# EAGLE design pca9685 board (EAGLE 7.2.0)
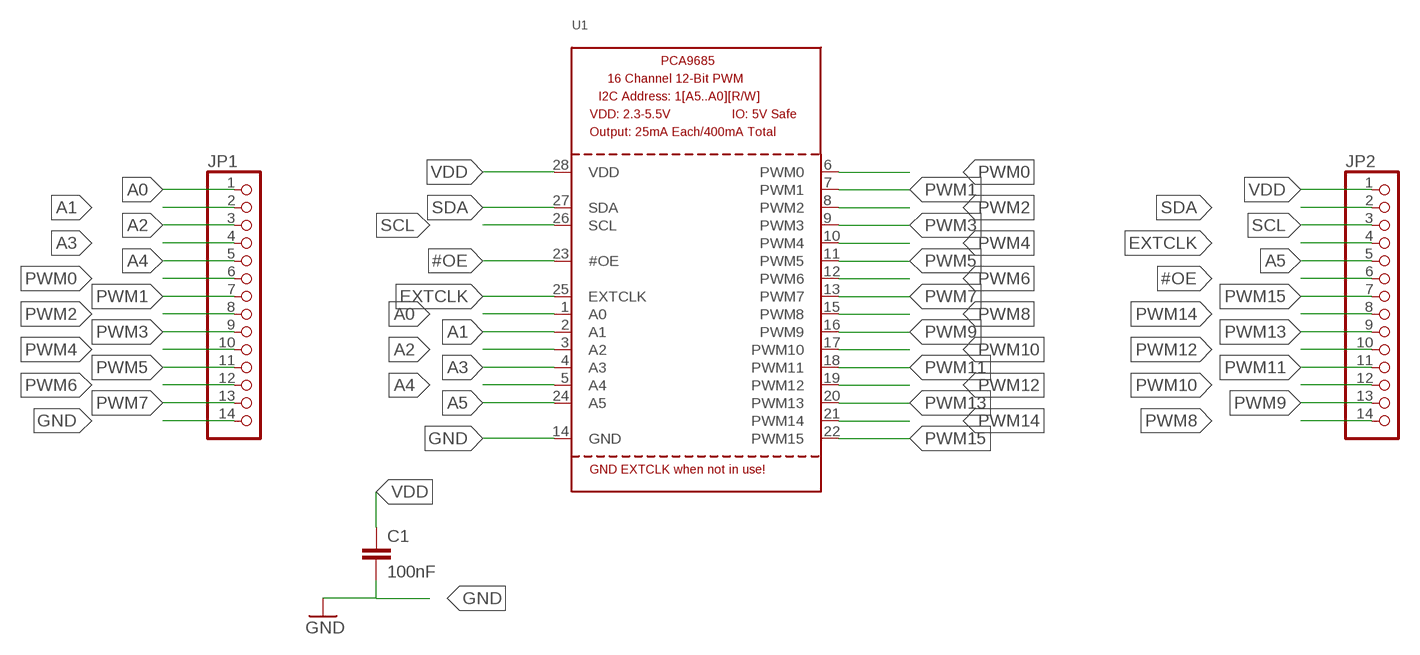
[diagram p0: schematic, sheet 1]

## Parts
C1  100nF  C-EUC0805  [C0805]
JP1  PINHD-1X14  [1X14]
JP2  PINHD-1X14  [1X14]
U1  PCA9685  [TSSOP28]

## Nets
#OE: JP2.6 U1.23(#OE)
A0: JP1.1 U1.1(A0)
A1: JP1.2 U1.2(A1)
A2: JP1.3 U1.3(A2)
A3: JP1.4 U1.4(A3)
A4: JP1.5 U1.5(A4)
A5: JP2.5 U1.24(A5)
EXTCLK: JP2.4 U1.25(EXTCLK)
GND: C1.2 JP1.14 U1.14(GND)
PWM0: JP1.6 U1.6(PWM0)
PWM1: JP1.7 U1.7(PWM1)
PWM2: JP1.8 U1.8(PWM2)
PWM3: JP1.9 U1.9(PWM3)
PWM4: JP1.10 U1.10(PWM4)
PWM5: JP1.11 U1.11(PWM5)
PWM6: JP1.12 U1.12(PWM6)
PWM7: JP1.13 U1.13(PWM7)
PWM8: JP2.14 U1.15(PWM8)
PWM9: JP2.13 U1.16(PWM9)
PWM10: JP2.12 U1.17(PWM10)
PWM11: JP2.11 U1.18(PWM11)
PWM12: JP2.10 U1.19(PWM12)
PWM13: JP2.9 U1.20(PWM13)
PWM14: JP2.8 U1.21(PWM14)
PWM15: JP2.7 U1.22(PWM15)
SCL: JP2.3 U1.26(SCL)
SDA: JP2.2 U1.27(SDA)
VDD: C1.1 JP2.1 U1.28(VDD)

## Library data of the parts
C1 = rcl:C-EU: CAPACITOR, European symbol
JP1 JP2 = pinhead:PINHD-1X14: PIN HEADER
U1 = adafruit:PCA9685: PCA9685 - 16 Channel 12-Bit I2C PWM Controller 5.0V tolerant 16 channel, 12-bit I2C PWM controller with 25mA per output (max. 400mA total) Digikey: 568-5931-1-ND

## Net classes
0 default: width 0.254 mm, clearance 0.356 mm

## Board
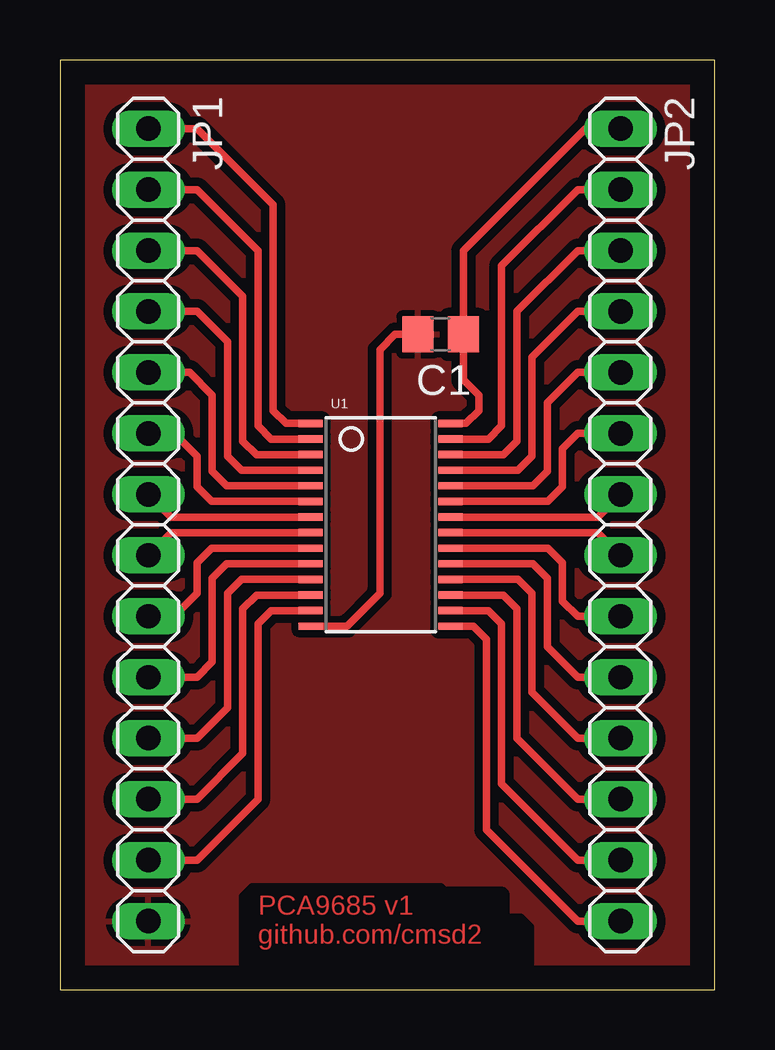
[diagram p1: board, top side]

Size 27.31 x 38.73 mm. Coordinates in mm from the lower left corner, seen from the top.
Outline: 0,0 27.31,0 27.31,38.73 0,38.73 0,0
Copper layers (1*16): Top 0.035mm / dielectric 1.5mm / Bottom 0.035mm
Design rules "default": minimum track width 10mil, minimum drill 24mil, track to track 8mil, track to pad 8mil, pad to pad 8mil, via to via 8mil, smd to smd 8mil, copper to edge 40mil, drill to drill 8mil, minimum pad ring 10mil, minimum via ring 8mil, stop-mask expansion 4mil, vias tented up to drill 0mil, thermal gap 10mil
tRestrict: area 9.7,14.7 to 14.1,27.8; area 7.6,0.6 to 19.6,4.3

### Footprints (pad centres in the part's own frame; a part is rotated, then mirrored left to right if it is on the bottom)
C0805 = smd 1.3 x 1.5: 1 -0.95,0; 2 0.95,0
1X14 = drill 1.016 long: 1 -16.51,0; 2 -13.97,0; 3 -11.43,0; 4 -8.89,0; 5 -6.35,0; 6 -3.81,0; 7 -1.27,0; 8 1.27,0; 9 3.81,0; 10 6.35,0; 11 8.89,0; 12 11.43,0; 13 13.97,0; 14 16.51,0
TSSOP28 = smd 0.305 x 0.991: 1 -4.225,-2.918; 2 -3.575,-2.918; 3 -2.925,-2.918; 4 -2.275,-2.918; 5 -1.625,-2.918; 6 -0.975,-2.918; 7 -0.325,-2.918; 8 0.325,-2.918; 9 0.975,-2.918; 10 1.625,-2.918; 11 2.275,-2.918; 12 2.925,-2.918; 13 3.575,-2.918; 14 4.225,-2.918; 15 4.225,2.918; 16 3.575,2.918; 17 2.925,2.918; 18 2.275,2.918; 19 1.625,2.918; 20 0.975,2.918; 21 0.325,2.918; 22 -0.325,2.918; 23 -0.975,2.918; 24 -1.625,2.918; 25 -2.275,2.918; 26 -2.925,2.918; 27 -3.575,2.918; 28 -4.225,2.918

### Placement (x,y rotation side)
C1  15.88,27.31 180 top
JP1  3.68,19.37 270 top
JP2  23.37,19.37 270 top
U1  13.37,19.37 270 top

### Tracks (layer width: path | path; a pad name or v marks a point on that pad's centre or on a via)
#OE
  Top 0.305: U1.23 20.34,20.34 20.96,20.96 20.96,22.54 21.59,23.18 JP2.6
A0
  Top 0.305: U1.1 9.43,23.59 8.89,24.13 8.89,32.7 5.71,35.88 JP1.1
A1
  Top 0.305: U1.2 8.81,22.94 8.26,23.5 8.26,30.8 5.71,33.34 JP1.2
A2
  Top 0.305: U1.3 8.19,22.29 7.62,22.86 7.62,28.89 5.71,30.8 JP1.3
A3
  Top 0.305: U1.4 7.57,21.64 6.98,22.23 6.98,26.99 5.71,28.26 JP1.4
A4
  Top 0.305: U1.5 6.95,20.99 6.35,21.59 6.35,24.77 5.4,25.72 JP1.5
A5
  Top 0.305: U1.24 19.72,20.99 20.32,21.59 20.32,24.45 21.59,25.72 JP2.5
EXTCLK
  Top 0.305: U1.25 19.1,21.64 19.69,22.23 19.69,26.35 21.59,28.26 JP2.4
GND
  Top 0.305: C1.2 13.97,27.31 13.33,26.67 13.33,16.51 11.97,15.14 U1.14 | U1.14
  pour Top (rank 2): -3.81,39.37 -3.25,39.93 arc-45 -3.07,40 32.38,40 32.95,39.44 arc-45 33.02,39.26 33.02,-3.17 -2.54,-3.17 -3.74,-1.98 arc-45 -3.81,-1.8
PWM0
  Top 0.305: U1.6 6.33,20.34 5.71,20.96 5.71,22.23 4.76,23.18 JP1.6
PWM1
  Top 0.305: U1.7 4.63,19.69 JP1.7
PWM2
  Top 0.305: U1.8 4.63,19.04 JP1.8
PWM3
  Top 0.305: U1.9 6.33,18.39 5.71,17.78 5.71,16.51 4.76,15.56 JP1.9
PWM4
  Top 0.305: U1.10 6.95,17.74 6.35,17.15 6.35,13.65 5.71,13.02 JP1.10
PWM5
  Top 0.305: U1.11 7.57,17.09 6.98,16.51 6.98,11.75 5.71,10.48 JP1.11
PWM6
  Top 0.305: U1.12 8.19,16.44 7.62,15.88 7.62,9.84 5.71,7.94 JP1.12
PWM7
  Top 0.305: U1.13 8.81,15.79 8.26,15.24 8.26,7.94 5.71,5.4 JP1.13
PWM8
  Top 0.305: U1.15 17.24,15.14 17.78,14.61 17.78,6.67 21.59,2.86 JP2.14
PWM9
  Top 0.305: U1.16 17.86,15.79 18.42,15.24 18.42,8.57 21.59,5.4 JP2.13
PWM10
  Top 0.305: U1.17 18.48,16.44 19.05,15.88 19.05,10.48 21.59,7.94 JP2.12
PWM11
  Top 0.305: U1.18 19.1,17.09 19.69,16.51 19.69,12.38 21.59,10.48 JP2.11
PWM12
  Top 0.305: U1.19 19.72,17.74 20.32,17.15 20.32,14.29 21.59,13.02 JP2.10
PWM13
  Top 0.305: U1.20 20.34,18.39 20.96,17.78 20.96,16.19 21.59,15.56 JP2.9
PWM14
  Top 0.305: U1.21 22.42,19.04 JP2.8
PWM15
  Top 0.305: U1.22 22.42,19.69 JP2.7
SCL
  Top 0.305: U1.26 18.48,22.29 19.05,22.86 19.05,28.26 21.59,30.8 JP2.3
SDA
  Top 0.305: U1.27 17.86,22.94 18.42,23.5 18.42,30.16 21.59,33.34 JP2.2
VDD
  Top 0.305: C1.1 16.83,25.4 | 16.83,25.4 16.83,30.8 21.91,35.88 JP2.1 | 16.83,25.4 17.46,24.77 17.46,24.13 16.93,23.59 U1.28

### Text on the board
Top: PCA9685 v1 / github.com/cmsd2